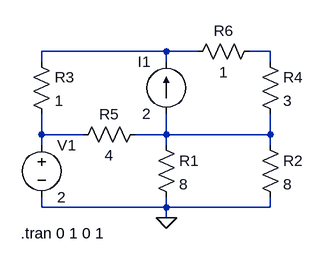
[diagram p0: schematic Circuit_10.asc]
Circuit_10.asc, the LTspice schematic file:
Version 4.1
SHEET 1 880 680
WIRE 224 16 32 16
WIRE 272 16 224 16
WIRE 384 16 352 16
WIRE 32 32 32 16
WIRE 224 32 224 16
WIRE 384 32 384 16
WIRE 32 144 32 112
WIRE 96 144 32 144
WIRE 224 144 224 112
WIRE 224 144 176 144
WIRE 384 144 384 112
WIRE 384 144 224 144
WIRE 32 160 32 144
WIRE 224 160 224 144
WIRE 384 160 384 144
WIRE 32 256 32 240
WIRE 224 256 224 240
WIRE 224 256 32 256
WIRE 384 256 384 240
WIRE 384 256 224 256
WIRE 224 272 224 256
FLAG 224 272 0
SYMBOL voltage 32 144 R0
WINDOW 123 0 0 Left 0
WINDOW 39 0 0 Left 0
SYMATTR InstName V1
SYMATTR Value 2
SYMBOL res 208 144 R0
SYMATTR InstName R1
SYMATTR Value 8
SYMBOL res 368 144 R0
SYMATTR InstName R2
SYMATTR Value 8
SYMBOL res 16 16 R0
SYMATTR InstName R3
SYMATTR Value 1
SYMBOL res 368 16 R0
SYMATTR InstName R4
SYMATTR Value 3
SYMBOL res 192 128 R90
WINDOW 0 0 56 VBottom 2
WINDOW 3 32 56 VTop 2
SYMATTR InstName R5
SYMATTR Value 4
SYMBOL res 368 0 R90
WINDOW 0 0 56 VBottom 2
WINDOW 3 32 56 VTop 2
SYMATTR InstName R6
SYMATTR Value 1
SYMBOL current 224 112 R180
WINDOW 0 24 80 Left 2
WINDOW 3 24 0 Left 2
WINDOW 123 0 0 Left 0
WINDOW 39 0 0 Left 0
SYMATTR InstName I1
SYMATTR Value 2
TEXT 0 296 Left 2 !.tran 0 1 0 1

The netlist it stands for:
* Circuit_10.asc
V1 N003 0 2
R1 N004 0 8
R2 N004 0 8
R3 N001 N003 1
R4 N002 N004 3
R5 N004 N003 4
R6 N002 N001 1
I1 N004 N001 2
.tran 0 1 0 1
.backanno
.end